# EAGLE schematic V2164MIXER v2 (EAGLE 9.5.0)
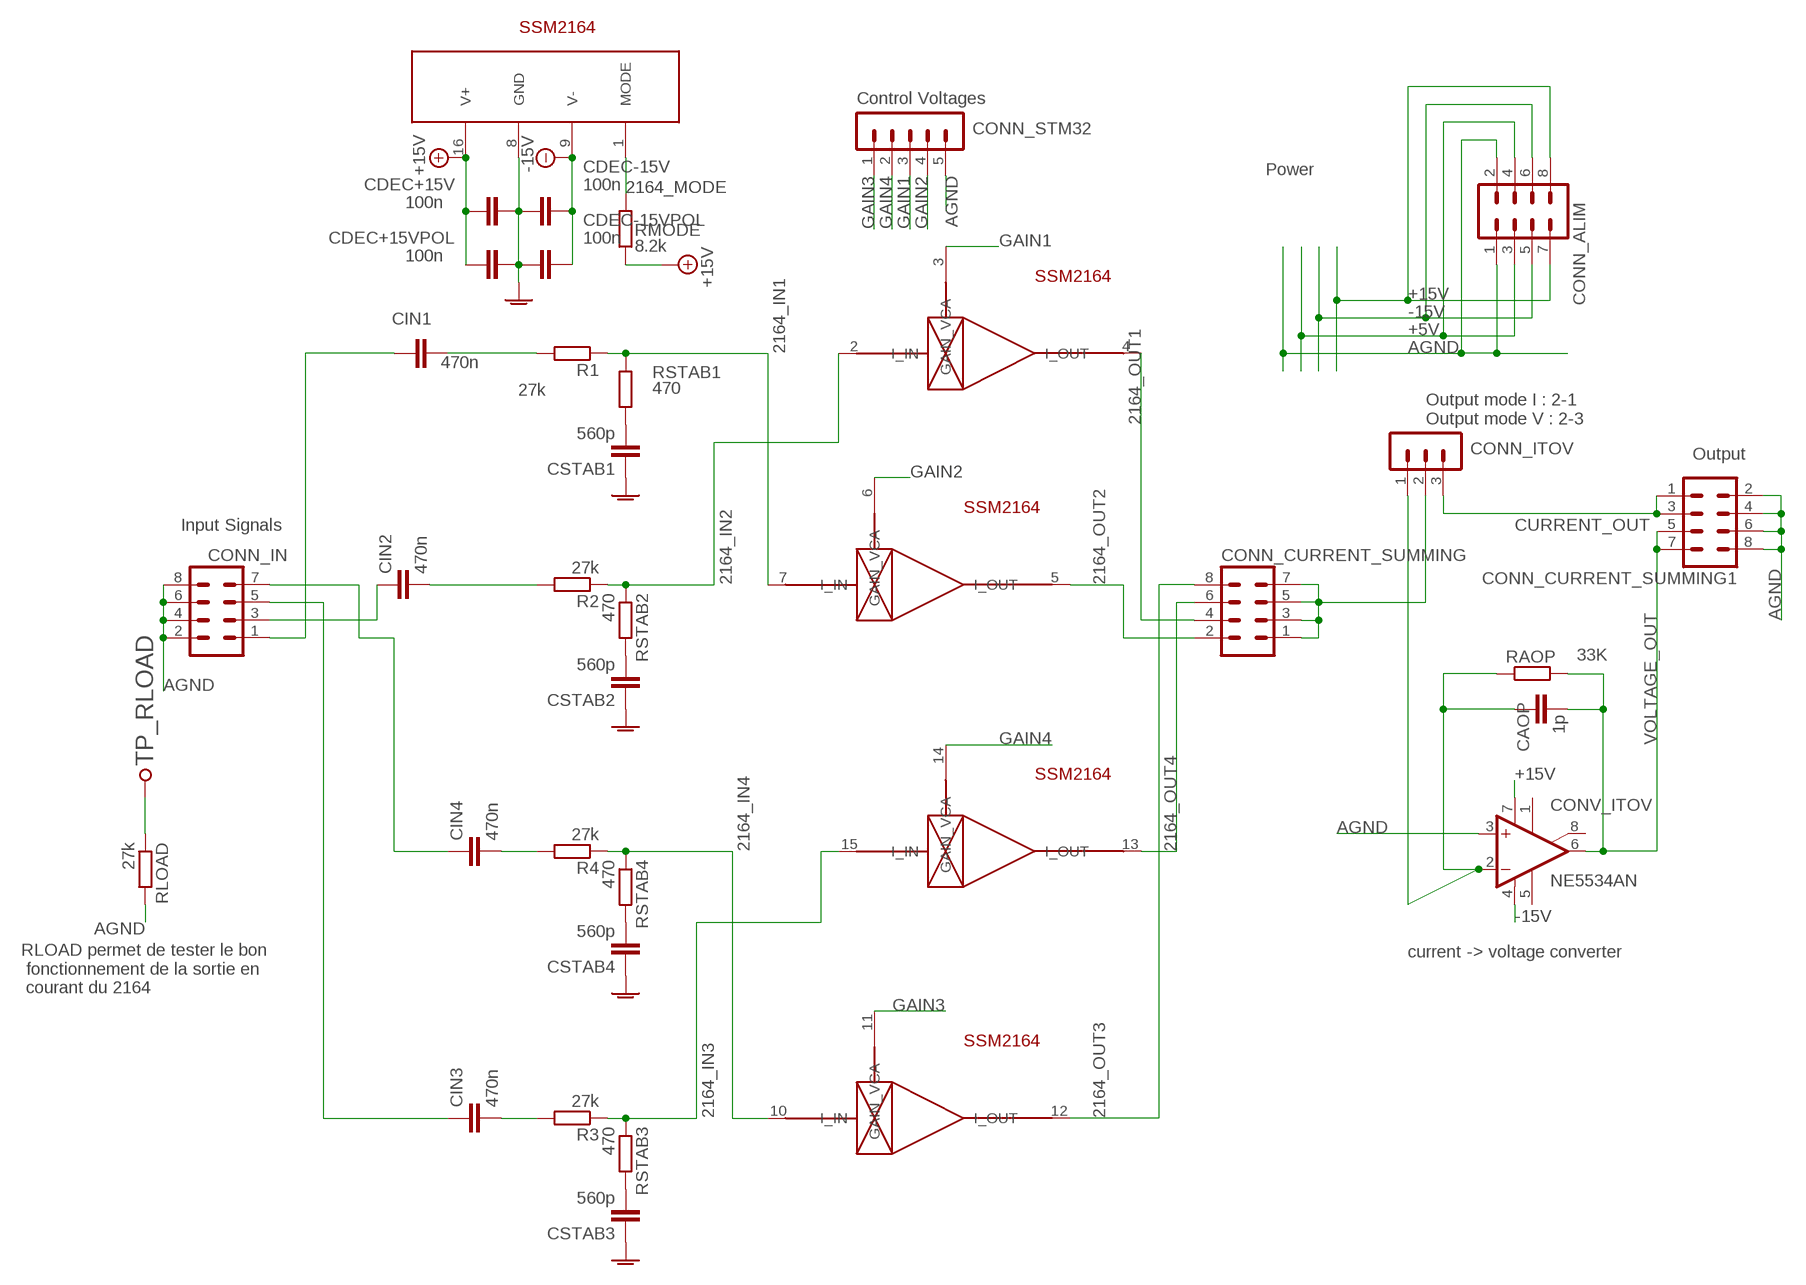
[diagram p0: schematic, sheet 1]

## Parts
CAOP  1p  C-EU050-030X075  [C050-030X075]
CDEC+15V  100n  C-EU050-030X075  [C050-030X075]
CDEC+15VPOL  100n  C-EU075-032X103  [C075-032X103]
CDEC-15V  100n  C-EU050-030X075  [C050-030X075]
CDEC-15VPOL  100n  C-EU050-030X075  [C050-030X075]
CIN1  470n  C-EU050-030X075  [C050-030X075]
CIN2  470n  C-EU050-030X075  [C050-030X075]
CIN3  470n  C-EU050-030X075  [C050-030X075]
CIN4  470n  C-EU050-030X075  [C050-030X075]
CONN_ALIM  MA04-2  [MA04-2]
CONN_CURRENT_SUMMING  MA04-2  [MA04-2]
CONN_CURRENT_SUMMING1  MA04-2  [MA04-2]
CONN_IN  MA04-2  [MA04-2]
CONN_ITOV  MA03-1  [MA03-1]
CONN_STM32  MA05-1  [MA05-1]
CONV_ITOV  NE5534AN  [DIL08]
CSTAB1  560p  C-EU050-030X075  [C050-030X075]
CSTAB2  560p  C-EU050-030X075  [C050-030X075]
CSTAB3  560p  C-EU050-030X075  [C050-030X075]
CSTAB4  560p  C-EU050-030X075  [C050-030X075]
MIXER  SSM2164_MULTI  [DIL16]
R1  27k  R-EU_0207/10  [0207/10]
R2  27k  R-EU_0204/7  [0204/7]
R3  27k  R-EU_0204/7  [0204/7]
R4  27k  R-EU_0204/7  [0204/7]
RAOP  33K  R-EU_0204/7  [0204/7]
RLOAD  27k  R-EU_0204/7  [0204/7]
RMODE  8.2k  R-EU_0204/7  [0204/7]
RSTAB1  470  R-EU_0207/10  [0207/10]
RSTAB2  470  R-EU_0204/7  [0204/7]
RSTAB3  470  R-EU_0204/7  [0204/7]
RSTAB4  470  R-EU_0204/7  [0204/7]
TP_RLOAD  TESTPOINT  [TESTPOINT_63]

## Nets
2164_IN1: MIXER.7(I_IN) R1.1 RSTAB1.1
2164_IN2: MIXER.2(I_IN) R2.1 RSTAB2.1
2164_IN3: MIXER.15(I_IN) R3.1 RSTAB3.1
2164_IN4: MIXER.10(I_IN) R4.1 RSTAB4.1
2164_MODE: MIXER.1(MODE) RMODE.2
2164_OUT1: CONN_CURRENT_SUMMING.4 MIXER.4(I_OUT)
2164_OUT2: CONN_CURRENT_SUMMING.2 MIXER.5(I_OUT)
2164_OUT3: CONN_CURRENT_SUMMING.8 MIXER.12(I_OUT)
2164_OUT4: CONN_CURRENT_SUMMING.6 MIXER.13(I_OUT)
+5V: CONN_ALIM.3 CONN_ALIM.4
+15V: CDEC+15V.2 CDEC+15VPOL.2 CONN_ALIM.7 CONN_ALIM.8 CONV_ITOV.7(V+) MIXER.16(V+) RMODE.1
-15V: CDEC-15V.1 CDEC-15VPOL.1 CONN_ALIM.5 CONN_ALIM.6 CONV_ITOV.4(V-) MIXER.9(V-)
AGND: CDEC+15V.1 CDEC+15VPOL.1 CDEC-15V.2 CDEC-15VPOL.2 CONN_ALIM.1 CONN_ALIM.2 CONN_CURRENT_SUMMING1.2 CONN_CURRENT_SUMMING1.4 CONN_CURRENT_SUMMING1.6 CONN_CURRENT_SUMMING1.8 CONN_IN.2 CONN_IN.4 CONN_IN.6 CONN_IN.8 CONN_STM32.5 CONV_ITOV.3(+IN) CSTAB1.1 CSTAB2.1 CSTAB3.1 CSTAB4.1 MIXER.8(GND) RLOAD.2
CURRENT_OUT: CONN_CURRENT_SUMMING1.1 CONN_CURRENT_SUMMING1.3 CONN_ITOV.3
GAIN1: CONN_STM32.3 MIXER.3(GAIN_VCA)
GAIN2: CONN_STM32.4 MIXER.6(GAIN_VCA)
GAIN3: CONN_STM32.1 MIXER.11(GAIN_VCA)
GAIN4: CONN_STM32.2 MIXER.14(GAIN_VCA)
MIXER_OUT: CONN_CURRENT_SUMMING.1 CONN_CURRENT_SUMMING.3 CONN_CURRENT_SUMMING.5 CONN_CURRENT_SUMMING.7 CONN_ITOV.2
N$1: CIN1.1 CONN_IN.1
N$2: CIN2.1 CONN_IN.3
N$3: CIN4.1 CONN_IN.7
N$4: CIN3.1 CONN_IN.5
N$5: CIN3.2 R3.2
N$7: CSTAB3.2 RSTAB3.2
N$11: CIN1.2 R1.2
N$12: CAOP.1 CONN_ITOV.1 CONV_ITOV.2(-IN) RAOP.1
N$22: RLOAD.1 TP_RLOAD.P$1
N$33: CSTAB1.2 RSTAB1.2
N$34: CSTAB2.2 RSTAB2.2
N$35: CIN2.2 R2.2
N$41: CSTAB4.2 RSTAB4.2
N$71: CIN4.2 R4.2
VOLTAGE_OUT: CAOP.2 CONN_CURRENT_SUMMING1.5 CONN_CURRENT_SUMMING1.7 CONV_ITOV.6(OUT) RAOP.2
Unconnected: CONV_ITOV.1(ON) CONV_ITOV.5(CMP) CONV_ITOV.8(ON/CMP)

## Notes on the sheet
- Control Voltages
- Power
- Output mode I : 2-1
  Output mode V : 2-3
- Output
- Input Signals
- current -> voltage converter
- RLOAD permet de tester le bon
   fonctionnement de la sortie en
   courant du 2164

## Library data of the parts
CAOP CIN1-CIN4 = rcl:C-EU: CAPACITOR, European symbol; C3: 0.47 micro; SPICEPREFIX: C
CDEC+15V CDEC+15VPOL CDEC-15V CDEC-15VPOL CSTAB1-CSTAB4 = rcl:C-EU: CAPACITOR, European symbol; SPICEPREFIX: C
CONN_ALIM CONN_CURRENT_SUMMING CONN_CURRENT_SUMMING1 CONN_IN = con-lstb:MA04-2: PIN HEADER; OC_FARNELL: unknown; OC_NEWARK: unknown
CONN_ITOV = con-lstb:MA03-1: PIN HEADER; OC_FARNELL: unknown; OC_NEWARK: unknown
CONN_STM32 = con-lstb:MA05-1: PIN HEADER; OC_FARNELL: unknown; OC_NEWARK: unknown
CONV_ITOV = linear:NE5534: LOW-NOISE OPERATIONAL AMPLIFIER Source: http://focus.ti.com/lit/ds/symlink/ne5534.pdf
MIXER = analog-audio-chips:SSM2164_MULTI: Low Cost Quad Voltage Controlled Amplifier by Analog Devices (120 dB Gain Range)
R1-R4 RAOP RLOAD RMODE RSTAB1-RSTAB4 = rcl:R-EU_: RESISTOR, European symbol
TP_RLOAD = 6P1_EVB:TESTPOINT